# EAGLE design slave (EAGLE 9.0.1)
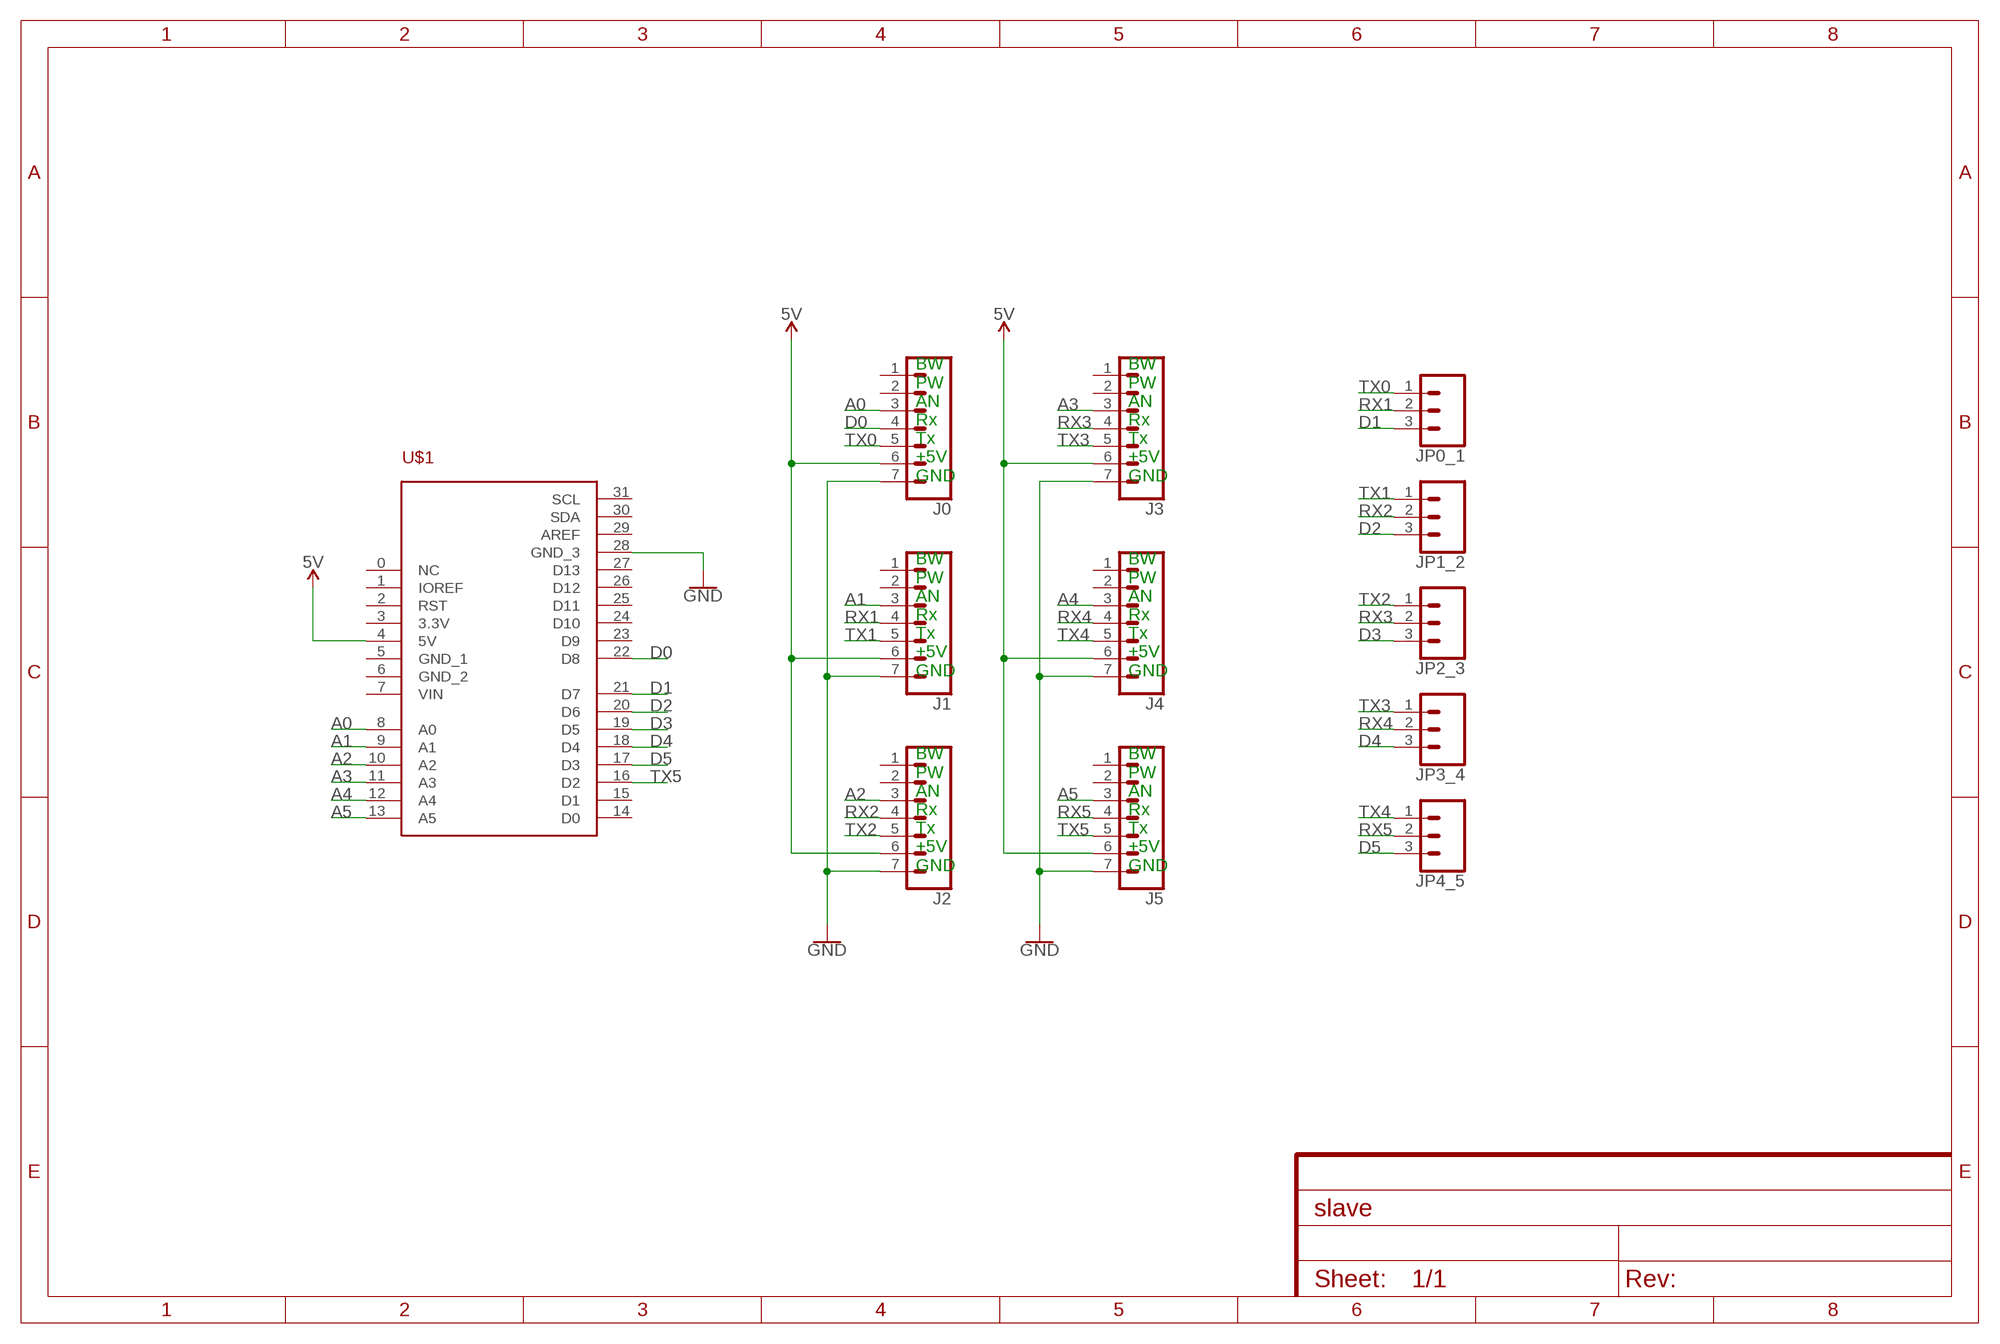
[diagram p0: schematic, sheet 1]
FRAME1 (FRAME-A4L): SPICEPREFIX: X

## Parts
J0  CONN_07LONGPADS  [1X07_LONGPADS]
J1  CONN_07LONGPADS  [1X07_LONGPADS]
J2  CONN_07LONGPADS  [1X07_LONGPADS]
J3  CONN_07LONGPADS  [1X07_LONGPADS]
J4  CONN_07LONGPADS  [1X07_LONGPADS]
J5  CONN_07LONGPADS  [1X07_LONGPADS]
JP0_1  CONN_03LONGPADS  [1X03_LONGPADS]
JP1_2  CONN_03LONGPADS  [1X03_LONGPADS]
JP2_3  CONN_03LONGPADS  [1X03_LONGPADS]
JP3_4  CONN_03LONGPADS  [1X03_LONGPADS]
JP4_5  CONN_03LONGPADS  [1X03_LONGPADS]
U$1  ARDUINO_UNO_STACK  [ARDUINO_UNO_STACK]

## Nets
5V: J0.6 J1.6 J2.6 J3.6 J4.6 J5.6 U$1.4(5V)
A0: J0.3 U$1.8(A0)
A1: J1.3 U$1.9(A1)
A2: J2.3 U$1.10(A2)
A3: J3.3 U$1.11(A3)
A4: J4.3 U$1.12(A4)
A5: J5.3 U$1.13(A5)
D0: J0.4 U$1.22(D8)
D1: JP0_1.3 U$1.21(D7)
D2: JP1_2.3 U$1.20(D6)
D3: JP2_3.3 U$1.19(D5)
D4: JP3_4.3 U$1.18(D4)
D5: JP4_5.3 U$1.17(D3)
GND: J0.7 J1.7 J2.7 J3.7 J4.7 J5.7 U$1.28(GND_3)
RX1: J1.4 JP0_1.2
RX2: J2.4 JP1_2.2
RX3: J3.4 JP2_3.2
RX4: J4.4 JP3_4.2
RX5: J5.4 JP4_5.2
TX0: J0.5 JP0_1.1
TX1: J1.5 JP1_2.1
TX2: J2.5 JP2_3.1
TX3: J3.5 JP3_4.1
TX4: J4.5 JP4_5.1
TX5: J5.5 U$1.16(D2)
Unconnected: J0.1 J0.2 J1.1 J1.2 J2.1 J2.2 J3.1 J3.2 J4.1 J4.2 J5.1 J5.2 U$1.0(NC) U$1.1(IOREF) U$1.2(RST) U$1.14(D0) U$1.15(D1) U$1.23(D9) U$1.24(D10) U$1.25(D11) U$1.26(D12) U$1.27(D13) U$1.29(AREF) U$1.30(SDA) U$1.31(SCL)

## Notes on the sheet
- BW
  PW
  AN
  Rx
  Tx
  +5V
  GND
- BW
  PW
  AN
  Rx
  Tx
  +5V
  GND
- BW
  PW
  AN
  Rx
  Tx
  +5V
  GND
- BW
  PW
  AN
  Rx
  Tx
  +5V
  GND
- BW
  PW
  AN
  Rx
  Tx
  +5V
  GND
- BW
  PW
  AN
  Rx
  Tx
  +5V
  GND

## Power pins joined to a net without a drawn wire
3.3V: U$1.3(3.3V)
GND_1: U$1.5(GND_1)
GND_2: U$1.6(GND_2)
VIN: U$1.7(VIN)

## Library data of the parts
J0 J1-J5 = SparkFun-Connectors:CONN_07: Multi connection point. Often used as Generic Header-pin footprint for 0.1 inch spaced/style header connections On any of the 0.1 inch spaced packages, you can populate with these: Break Away Headers - Straight <https://www.sparkfun.com/products/116> (PRT-00116) Break Away Male Headers - Right Angle <https://www.sparkfun.com/products/553> (PRT-00553) Female Headers <https://www.sparkfun.com/products/115> (PRT-00115) Break Away Headers - Machine Pin <https://www.sparkfun.com/products/117> (PRT-00117) Break Away Female Headers - Swiss Machine Pin <https://www.sparkfun.com/products/743> (PRT-00743) For SCREWTERMINALS and SPRING TERMINALS visit here: Screw Terimnals on SparkFun.com <https://www.sparkfun.com/search/results?term=Screw+Terminals> (5mm/3.5mm/2.54mm spacing) This device is also useful as a general connection point to wire up your design to another part of your project. Our various solder wires solder well into these plated through hole pads. Hook-Up Wire - Assortment (Stranded, 22 AWG) <https://www.sparkfun.com/products/11375> (PRT-11375) Hook-Up Wire - Assortment (Solid Core, 22 AWG) <https://www.sparkfun.com/products/11367> (PRT-11367) View the entire wire category on our website here <https://www.sparkfun.com/categories/141> Special notes: Molex polarized connector foot print use with SKU : PRT-08231 with associated crimp pins and housings. 1MM SMD Version SKU: PRT-10208 NOTES ON THE VARIANTS LOCK and LOCK_LONGPADS... This footprint was designed to help hold the alignment of a through-hole component (i.e. 6-pin header) while soldering it into place. You may notice that each hole has been shifted either up or down by 0.005 of an inch from it's more standard position (which is a perfectly straight line). This slight alteration caused the pins (the squares in the middle) to touch the edges of the holes. Because they are alternating, it causes a "brace" to hold the component in place. 0.005 has proven to be the perfect amount of "off-center" position when using our standard breakaway headers. Although looks a little odd when you look at the bare footprint, once you have a header in there, the alteration is very hard to notice. Also,if you push a header all the way into place, it is covered up entirely on the bottom side.
JP0_1 JP1_2 JP2_3 JP3_4 JP4_5 = SparkFun-Connectors:CONN_03: Multi connection point. Often used as Generic Header-pin footprint for 0.1 inch spaced/style header connections On any of the 0.1 inch spaced packages, you can populate with these: Break Away Headers - Straight <https://www.sparkfun.com/products/116> (PRT-00116) Break Away Male Headers - Right Angle <https://www.sparkfun.com/products/553> (PRT-00553) Female Headers <https://www.sparkfun.com/products/115> (PRT-00115) Break Away Headers - Machine Pin <https://www.sparkfun.com/products/117> (PRT-00117) Break Away Female Headers - Swiss Machine Pin <https://www.sparkfun.com/products/743> (PRT-00743) Stackable Header - 3 Pin (Female, 0.1") <https://www.sparkfun.com/products/13875> (PRT-13875) For SCREWTERMINALS and SPRING TERMINALS visit here: Screw Terimnals on SparkFun.com <https://www.sparkfun.com/search/results?term=Screw+Terminals> (5mm/3.5mm/2.54mm spacing) This device is also useful as a general connection point to wire up your design to another part of your project. Our various solder wires solder well into these plated through hole pads. Hook-Up Wire - Assortment (Stranded, 22 AWG) <https://www.sparkfun.com/products/11375> (PRT-11375) Hook-Up Wire - Assortment (Solid Core, 22 AWG) <https://www.sparkfun.com/products/11367> (PRT-11367) View the entire wire category on our website here <https://www.sparkfun.com/categories/141> Special notes: Molex polarized connector foot print use with SKU : PRT-08232 with associated crimp pins and housings.
U$1 = Justin-Eagle-Lib:ARDUINO_UNO_STACK

## Board
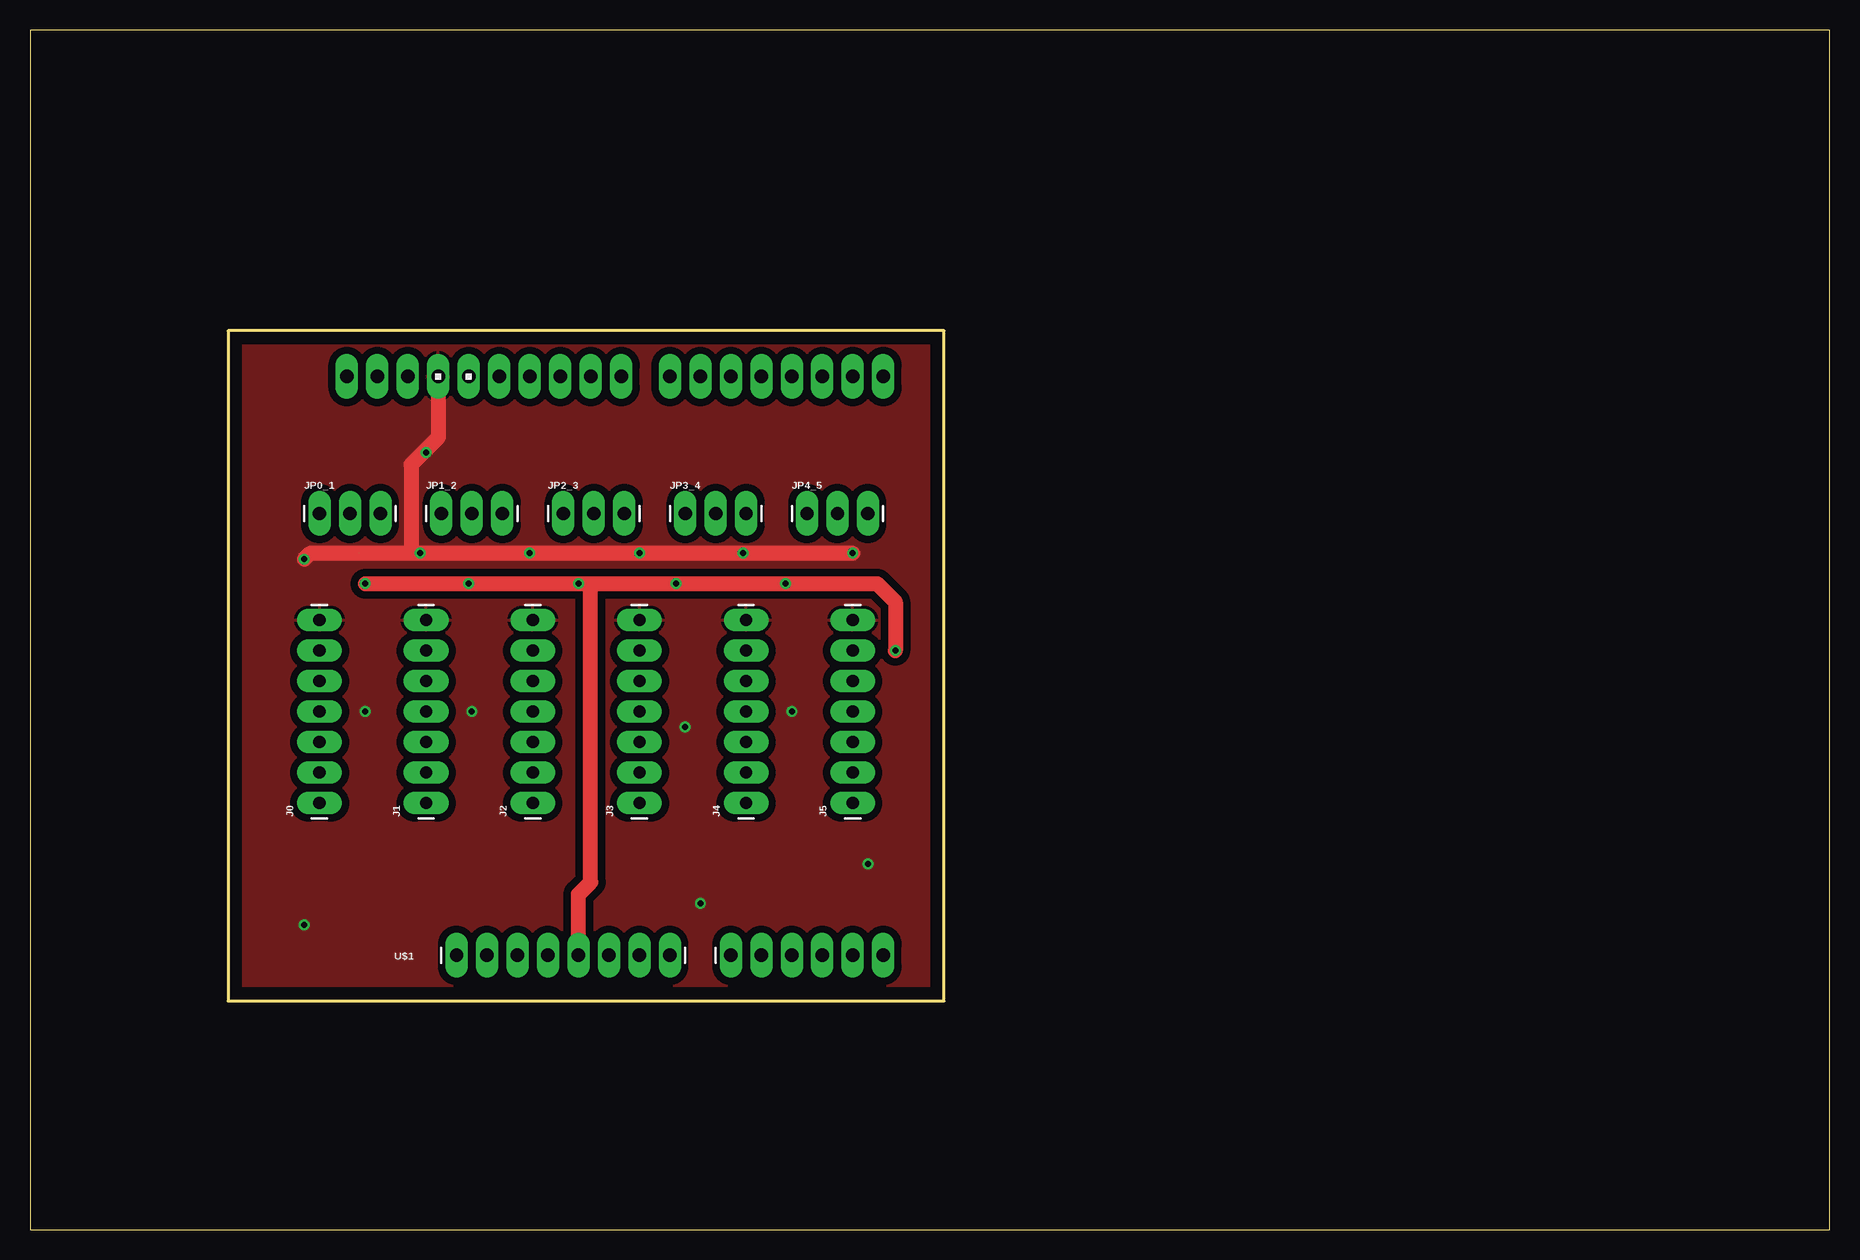
[diagram p1: board, top side]
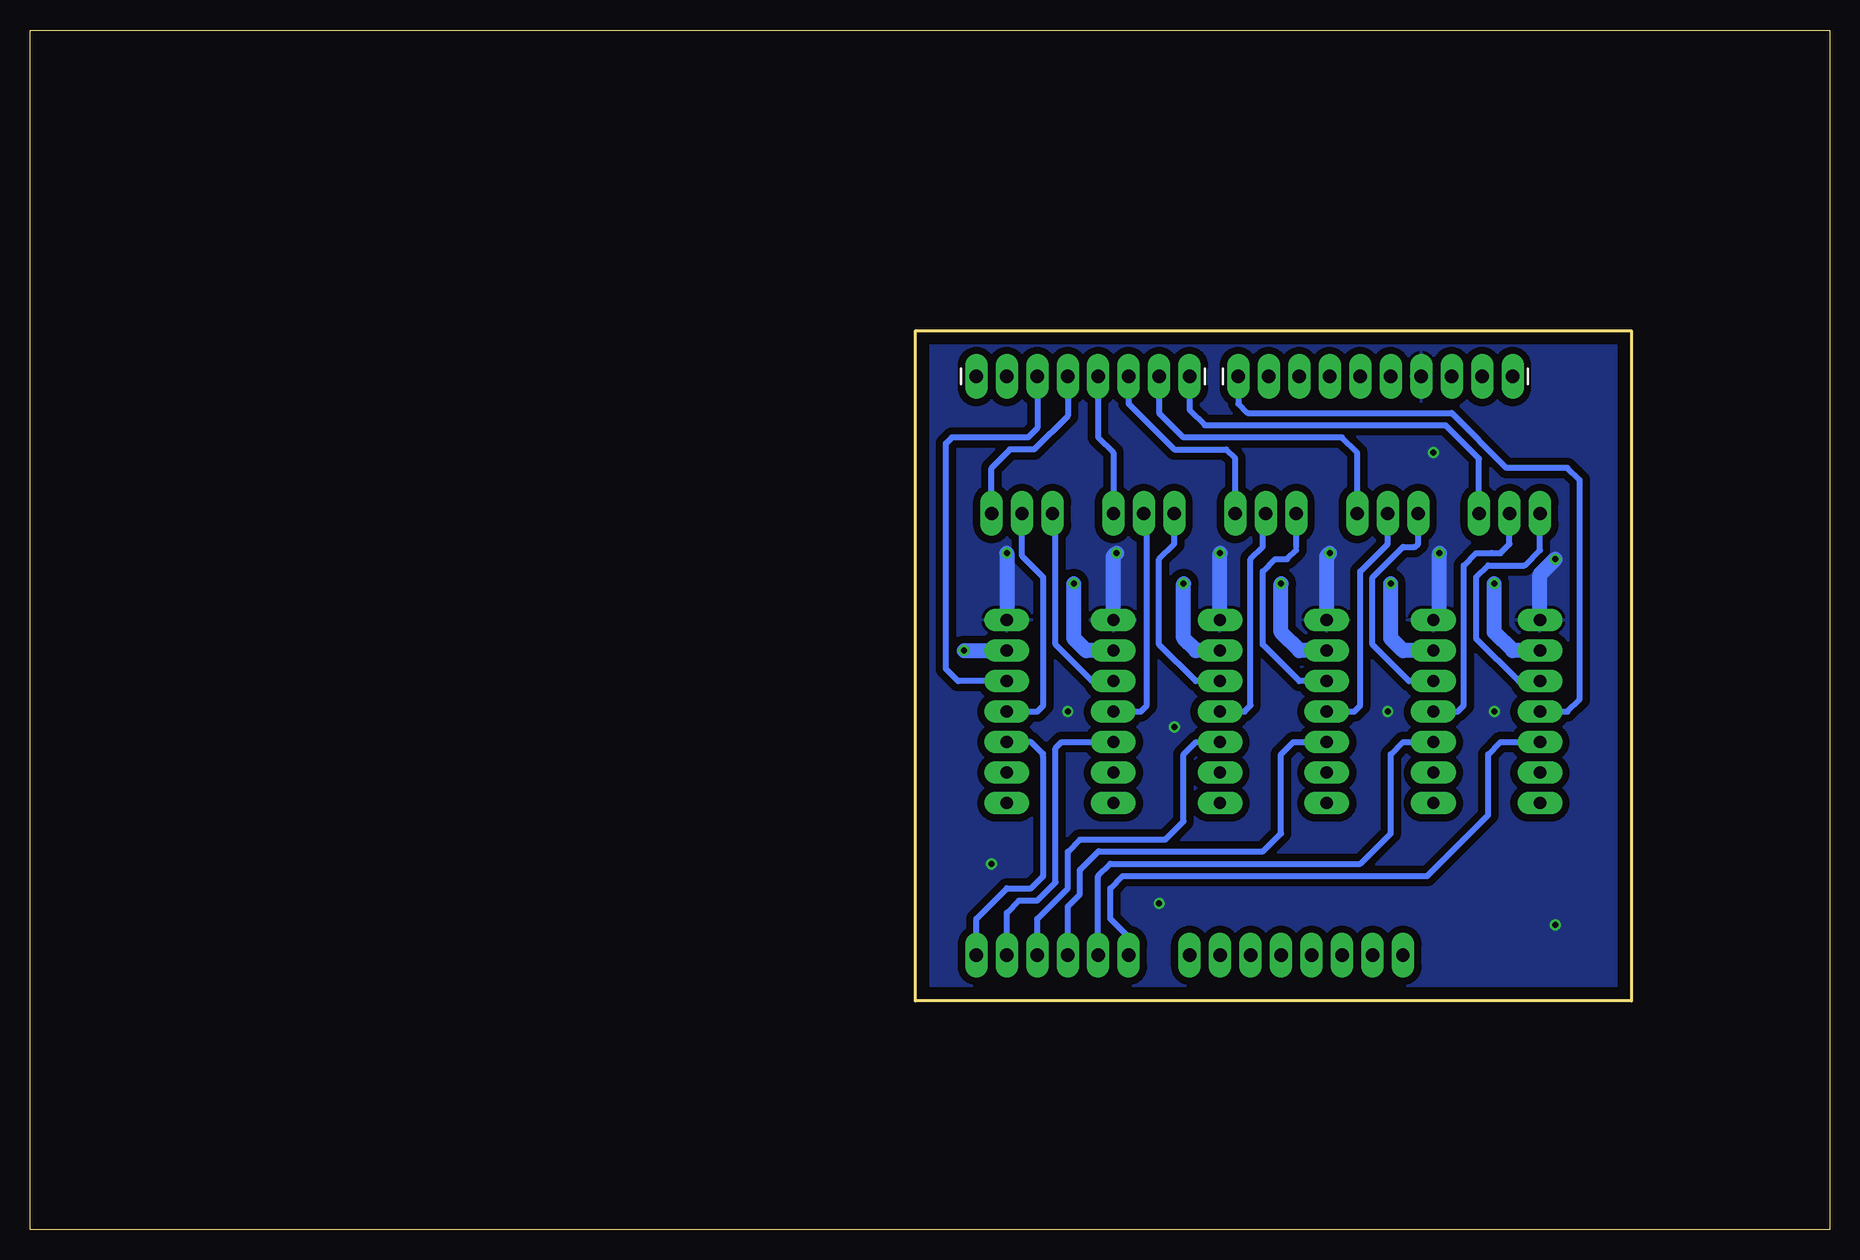
[diagram p2: board, bottom side, seen from below]

Size 150 x 100 mm. Coordinates in mm from the lower left corner, seen from the top.
Outline: 0,0 150,0 150,100 0,100 0,0
Outline: 16.51,19.05 76.2,19.05 76.2,74.93 16.51,74.93 16.51,19.05
Copper layers (1*16): Top 0.035mm / dielectric 1.5mm / Bottom 0.035mm
Design rules "default": minimum track width 6mil, minimum drill 0.35mm, track to track 6mil, track to pad 6mil, pad to pad 6mil, via to via 6mil, smd to smd 6mil, copper to edge 40mil, drill to drill 6mil, minimum pad ring 10mil, minimum via ring 8mil, stop-mask expansion 4mil, vias tented up to drill 0mil, thermal gap 10mil

### Footprints (pad centres in the part's own frame; a part is rotated, then mirrored left to right if it is on the bottom)
1X07_LONGPADS = drill 1.016 pad 1.88 long: 1 0,0; 2 2.54,0; 3 5.08,0; 4 7.62,0; 5 10.16,0; 6 12.7,0; 7 15.24,0
1X03_LONGPADS = drill 1.118 pad 1.88 long: 1 0,0; 2 2.54,0; 3 5.08,0
ARDUINO_UNO_STACK = drill 1.118 pad 1.88 long: 0 0,0; 1 2.54,0; 2 5.08,0; 3 7.62,0; 4 10.16,0; 5 12.7,0; 6 15.24,0; 7 17.78,0; 8 22.86,0; 9 25.4,0; 10 27.94,0; 11 30.48,0; 12 33.02,0; 13 35.56,0; 14 35.56,48.26; 15 33.02,48.26; 16 30.48,48.26; 17 27.94,48.26; 18 25.4,48.26; 19 22.86,48.26; 20 20.32,48.26; 21 17.78,48.26; 22 13.716,48.26; 23 11.176,48.26; 24 8.636,48.26; 25 6.096,48.26; 26 3.556,48.26; 27 1.016,48.26; 28 -1.524,48.26; 29 -4.064,48.26; 30 -6.604,48.26; 31 -9.144,48.26

### Placement (x,y rotation side)
J0  24.13,35.56 90 top
J1  33.02,35.56 90 top
J2  41.91,35.56 90 top
J3  50.8,35.56 90 top
J4  59.69,35.56 90 top
J5  68.58,35.56 90 top
JP0_1  24.13,59.69 0 top
JP1_2  34.29,59.69 0 top
JP2_3  44.45,59.69 0 top
JP3_4  54.61,59.69 0 top
JP4_5  64.77,59.69 0 top
U$1  35.56,22.86 0 top

### Tracks (layer width: path | path; a pad name or v marks a point on that pad's centre or on a via)
5V  (via drill 0.5 pad 0.8)
  Top 1.27: v27.94,53.85 v36.58,53.85 v45.72,53.85 46.74,53.85 | 46.74,53.85 v53.85,53.85 v62.99,53.85 70.61,53.85 72.14,52.32 v72.14,48.26 | U$1.4 45.72,27.94 46.74,28.96 46.74,53.85
  Bottom 1.27: v27.94,53.85 27.94,49.78 26.42,48.26 J0.6 | v36.58,53.85 36.58,49.28 35.56,48.26 J1.6 | J3.6 52.83,48.26 53.85,49.28 v53.85,53.85 | J4.6 61.98,48.26 62.99,49.28 v62.99,53.85 | J2.6 44.2,48.26 45.72,49.78 v45.72,53.85 | v72.14,48.26 J5.6
A0
  Bottom 0.508: U$1.8 58.42,24.38 59.94,25.91 59.94,28.45 58.93,29.46 33.53,29.46 28.45,34.54 28.45,39.62 27.43,40.64 J0.3
A1
  Bottom 0.508: U$1.9 60.96,29.46 59.94,30.48 39.12,30.48 36.58,33.02 36.58,39.62 35.56,40.64 J1.3
A2
  Bottom 0.254: 42.16,40.64 J2.3
  Bottom 0.508: U$1.10 63.5,26.92 62.48,27.94 62.48,29.97 60.94,31.52 47.22,31.52 45.72,33.02 45.72,39.62 44.7,40.64 42.16,40.64
A3
  Bottom 0.254: U$1.11 65.53,23.37
  Bottom 0.508: U$1.11 66.04,25.91 63.5,28.45 63.5,31.5 62.48,32.51 55.37,32.51 53.85,34.04 53.85,39.62 52.83,40.64 J3.3
A4
  Bottom 0.254: 59.94,40.64 J4.3
  Bottom 0.508: U$1.12 68.58,26.42 67.56,27.43 66.04,27.43 64.52,28.96 64.52,40.13 64.01,40.64 59.94,40.64
A5
  Bottom 0.254: 65.53,39.62 66.55,40.64
  Bottom 0.508: U$1.13 71.12,25.91 68.58,28.45 66.55,28.45 65.53,29.46 65.53,39.38 65.56,39.4 65.56,39.65 66.55,40.64 J5.3
D0
  Bottom 0.508: J0.4 21.84,43.18 20.83,44.2 20.83,62.48 21.84,63.5 26.92,63.5 31.5,68.07 48.51,68.07 49.28,68.83 U$1.22
D1
  Bottom 0.508: JP0_1.3 29.21,64.26 32,67.06 52.07,67.06 53.34,68.33 U$1.21
D2
  Bottom 0.508: JP1_2.3 39.37,64.77 40.64,66.04 53.85,66.04 55.88,68.07 U$1.20
D3
  Bottom 0.508: JP2_3.3 49.53,64.26 50.29,65.02 54.61,65.02 55.5,65.91 55.88,66.29 58.42,68.83 U$1.19
D4
  Bottom 0.508: JP3_4.3 59.69,64.77 60.96,66.04 U$1.18
D5
  Bottom 0.508: JP4_5.3 69.85,63.5 68.33,65.02 66.29,65.02 63.5,67.82 U$1.17
GND  (via drill 0.5 pad 0.8)
  Top 1.27: v22.86,55.88 23.37,56.39 31.75,56.39 | 31.75,56.39 v32.51,56.39 v41.66,56.39 v50.8,56.39 v59.44,56.39 v68.58,56.39 | U$1.28 34.04,66.04 31.75,63.75 31.75,56.39
  Bottom 1.27: J0.7 24.13,54.61 v22.86,55.88 | v68.58,56.39 J5.7 | J1.7 32.51,51.31 v32.51,56.39 | J2.7 41.91,56.13 v41.66,56.39 | J3.7 v50.8,56.39 | J4.7 59.69,56.13 v59.44,56.39
  other vias: 33.02,64.77 69.85,30.48 55.88,27.18 27.94,43.18 36.83,43.18 54.61,41.91 63.5,43.18 22.86,25.4
  pour Bottom (isolate 0.61): 16.51,19.05 16.51,74.93 76.2,74.93 76.2,19.05
  pour Top (isolate 0.61): 16.51,19.05 16.51,74.93 76.2,74.93 76.2,19.05
N$1
  pour Bottom (isolate 0.61): 41.66,47.75 50.8,47.75 54.86,41.66 54.86,31.5 42.67,31.5 41.66,32.51
RX1  (1 unrouted)
  Bottom 0.508: J1.4 30.99,43.18 30.48,43.69 30.48,55.37 29.46,56.39 28.19,56.39 28.16,56.41 27.43,56.41 | JP0_1.2 26.67,57.15 27.43,56.39
RX2
  Bottom 0.508: J2.4 39.62,43.18 39.12,43.69 39.12,54.86 36.83,57.15 JP1_2.2
RX3
  Bottom 0.254: 46.99,59.44 JP2_3.2
  Bottom 0.508: J3.4 48.77,43.18 48.26,43.69 48.26,55.88 47.24,56.9 47.24,59.18 46.99,59.44
RX4
  Bottom 0.254: 57.15,59.44 JP3_4.2
  Bottom 0.508: J4.4 57.4,43.18 56.9,43.69 56.9,59.18 57.15,59.44
RX5
  Bottom 0.508: J5.4 66.04,43.18 65.53,43.69 65.53,54.36 67.31,56.13 JP4_5.2
TX0
  Bottom 0.254: 24.13,56.64 24.89,55.88
  Bottom 0.508: JP0_1.1 24.13,56.64 25.4,55.37 28.45,55.37 29.46,54.36 29.46,49.28 25.91,45.72 J0.5
TX1
  Bottom 0.508: JP1_2.1 34.29,57.15 34.54,56.9 35.56,56.9 38.1,54.36 38.1,48.77 35.05,45.72 J1.5
TX2
  Bottom 0.254: 44.45,56.64 44.45,56.9
  Bottom 0.508: 44.45,56.64 45.21,55.88 46.23,55.88 47.24,54.86 47.24,48.77 44.2,45.72 J2.5 | 44.45,56.9 JP2_3.1
TX3
  Bottom 0.254: 54.61,59.44 JP3_4.1
  Bottom 0.508: 54.61,59.44 54.61,57.15 55.88,55.88 55.88,48.77 52.83,45.72 J3.5
TX4
  Bottom 0.508: JP4_5.1 64.52,59.44 64.52,48.77 61.47,45.72 J4.5
TX5
  Bottom 0.508: J5.5 72.64,45.72 73.66,46.74 73.66,65.53 73.15,66.04 66.8,66.04 66.04,66.8 U$1.16